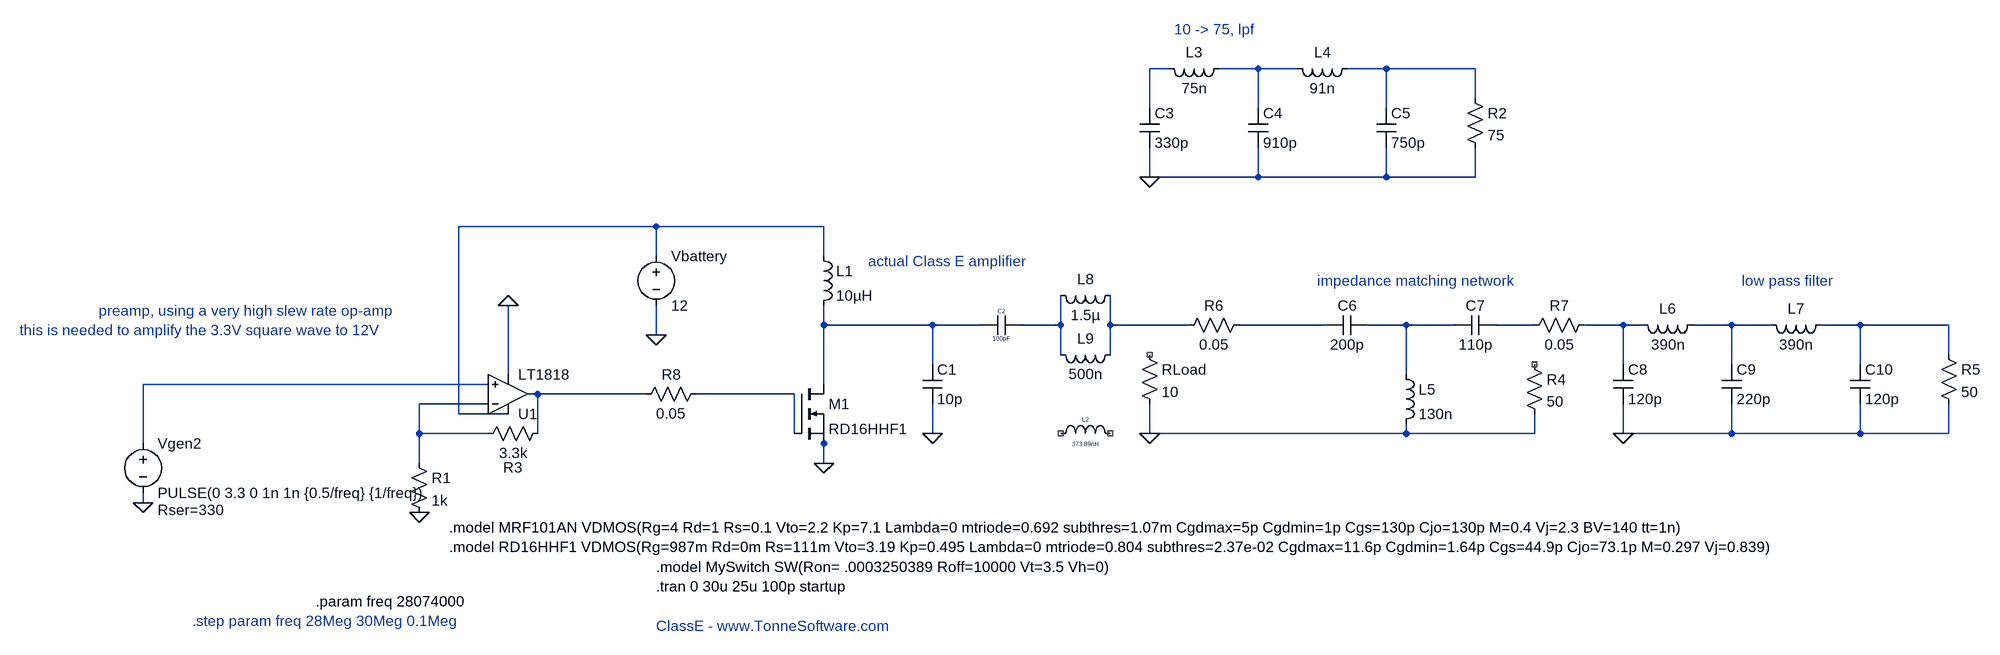
[diagram p0: schematic class_e_10mhz_opt2_real_components.asc]
class_e_10mhz_opt2_real_components.asc, the LTspice schematic file:
Version 4
SHEET 1 2440 912
WIRE 832 -528 800 -528
WIRE 976 -528 912 -528
WIRE 1040 -528 976 -528
WIRE 1184 -528 1120 -528
WIRE 1328 -528 1184 -528
WIRE 1328 -480 1328 -528
WIRE 800 -464 800 -528
WIRE 976 -464 976 -528
WIRE 1184 -464 1184 -528
WIRE 800 -352 800 -400
WIRE 976 -352 976 -400
WIRE 976 -352 800 -352
WIRE 1184 -352 1184 -400
WIRE 1184 -352 976 -352
WIRE 1328 -352 1328 -400
WIRE 1328 -352 1184 -352
WIRE 0 -272 -320 -272
WIRE 272 -272 0 -272
WIRE 0 -224 0 -272
WIRE 272 -224 272 -272
WIRE 272 -112 272 -144
WIRE 448 -112 272 -112
WIRE 528 -112 448 -112
WIRE 656 -112 656 -160
WIRE 656 -112 592 -112
WIRE 736 -112 736 -160
WIRE 864 -112 736 -112
WIRE 1088 -112 944 -112
WIRE 1216 -112 1152 -112
WIRE 1296 -112 1216 -112
WIRE 1424 -112 1360 -112
WIRE 1568 -112 1504 -112
WIRE 1600 -112 1568 -112
WIRE 1744 -112 1680 -112
WIRE 1808 -112 1744 -112
WIRE 1952 -112 1888 -112
WIRE 2096 -112 1952 -112
WIRE 0 -96 0 -144
WIRE 656 -64 656 -112
WIRE 736 -64 736 -112
WIRE 2096 -64 2096 -112
WIRE 448 -48 448 -112
WIRE 1568 -48 1568 -112
WIRE 1744 -48 1744 -112
WIRE 1952 -48 1952 -112
WIRE -240 -32 -240 -144
WIRE 1216 -32 1216 -112
WIRE -272 -16 -832 -16
WIRE 272 -16 272 -112
WIRE -192 0 -208 0
WIRE -16 0 -192 0
WIRE 224 0 64 0
WIRE -272 16 -384 16
WIRE -320 32 -320 -272
WIRE -240 32 -320 32
WIRE -384 64 -384 16
WIRE -272 64 -384 64
WIRE -192 64 -192 0
WIRE 224 64 224 0
WIRE 448 64 448 16
WIRE 800 64 800 16
WIRE 1216 64 1216 48
WIRE 1216 64 800 64
WIRE 1424 64 1424 32
WIRE 1424 64 1216 64
WIRE 1568 64 1568 16
WIRE 1744 64 1744 16
WIRE 1744 64 1568 64
WIRE 1952 64 1952 16
WIRE 1952 64 1744 64
WIRE 2096 64 2096 16
WIRE 2096 64 1952 64
WIRE -832 80 -832 -16
WIRE 272 80 272 64
WIRE -384 112 -384 64
WIRE 272 112 272 80
WIRE -832 176 -832 160
FLAG 272 112 0
FLAG 0 -96 0
FLAG 448 64 0
FLAG 800 64 0
FLAG -832 176 0
FLAG -384 192 0
FLAG -240 -144 0
FLAG 800 -352 0
FLAG 1568 64 0
SYMBOL voltage 0 -240 R0
WINDOW 123 24 132 Left 0
WINDOW 39 0 0 Left 0
SYMATTR InstName Vbattery
SYMATTR Value 12
SYMBOL ind 256 -240 R0
SYMATTR InstName L1
SYMATTR Value 10µH
SYMBOL cap 432 -48 R0
SYMATTR InstName C1
SYMATTR Value 10p
SYMBOL cap 592 -128 R90
WINDOW 0 0 32 VBottom 0
WINDOW 3 32 32 VTop 0
SYMATTR InstName C2
SYMATTR Value 100pF
SYMBOL ind 640 80 R270
WINDOW 0 32 56 VTop 0
WINDOW 3 5 56 VBottom 0
SYMATTR InstName L2
SYMATTR Value 373.89nH
SYMBOL res 784 -80 R0
SYMATTR InstName RLoad
SYMATTR Value 10
SYMBOL nmos 224 -16 R0
SYMATTR InstName M1
SYMATTR Value RD16HHF1
SYMBOL voltage -832 64 R0
WINDOW 123 24 132 Left 0
WINDOW 39 24 124 Left 2
SYMATTR SpiceLine Rser=330
SYMATTR InstName Vgen2
SYMATTR Value PULSE(0 3.3 0 1n 1n {0.5/freq} {1/freq})
SYMBOL res -400 96 R0
SYMATTR InstName R1
SYMATTR Value 1k
SYMBOL res -176 48 R90
WINDOW 0 86 57 VBottom 2
WINDOW 3 32 56 VTop 2
SYMATTR InstName R3
SYMATTR Value 3.3k
SYMBOL OpAmps\\LT1818 -240 0 M180
SYMATTR InstName U1
SYMBOL ind 928 -544 R90
WINDOW 0 5 56 VBottom 2
WINDOW 3 32 56 VTop 2
SYMATTR InstName L3
SYMATTR Value 75n
SYMBOL ind 1136 -544 R90
WINDOW 0 5 56 VBottom 2
WINDOW 3 32 56 VTop 2
SYMATTR InstName L4
SYMATTR Value 91n
SYMBOL cap 784 -464 R0
SYMATTR InstName C3
SYMATTR Value 330p
SYMBOL cap 960 -464 R0
SYMATTR InstName C4
SYMATTR Value 910p
SYMBOL cap 1168 -464 R0
SYMATTR InstName C5
SYMATTR Value 750p
SYMBOL res 1312 -496 R0
SYMATTR InstName R2
SYMATTR Value 75
SYMBOL cap 1152 -128 R90
WINDOW 0 0 32 VBottom 2
WINDOW 3 32 32 VTop 2
SYMATTR InstName C6
SYMATTR Value 200p
SYMBOL ind 1200 -48 R0
SYMATTR InstName L5
SYMATTR Value 130n
SYMBOL cap 1360 -128 R90
WINDOW 0 0 32 VBottom 2
WINDOW 3 32 32 VTop 2
SYMATTR InstName C7
SYMATTR Value 110p
SYMBOL res 1408 -64 R0
SYMATTR InstName R4
SYMATTR Value 50
SYMBOL ind 1696 -128 R90
WINDOW 0 5 56 VBottom 2
WINDOW 3 32 56 VTop 2
SYMATTR InstName L6
SYMATTR Value 390n
SYMBOL ind 1904 -128 R90
WINDOW 0 5 56 VBottom 2
WINDOW 3 32 56 VTop 2
SYMATTR InstName L7
SYMATTR Value 390n
SYMBOL cap 1552 -48 R0
SYMATTR InstName C8
SYMATTR Value 120p
SYMBOL cap 1728 -48 R0
SYMATTR InstName C9
SYMATTR Value 220p
SYMBOL cap 1936 -48 R0
SYMATTR InstName C10
SYMATTR Value 120p
SYMBOL res 2080 -80 R0
SYMATTR InstName R5
SYMATTR Value 50
SYMBOL ind 752 -176 R90
WINDOW 0 5 56 VBottom 2
WINDOW 3 32 56 VTop 2
SYMATTR InstName L8
SYMATTR Value 1.5µ
SYMBOL ind 752 -80 R90
WINDOW 0 5 56 VBottom 2
WINDOW 3 32 56 VTop 2
SYMATTR InstName L9
SYMATTR Value 500n
SYMBOL res 960 -128 R90
WINDOW 0 0 56 VBottom 2
WINDOW 3 32 56 VTop 2
SYMATTR InstName R6
SYMATTR Value 0.05
SYMBOL res 1520 -128 R90
WINDOW 0 0 56 VBottom 2
WINDOW 3 32 56 VTop 2
SYMATTR InstName R7
SYMATTR Value 0.05
SYMBOL res 80 -16 R90
WINDOW 0 0 56 VBottom 2
WINDOW 3 32 56 VTop 2
SYMATTR InstName R8
SYMATTR Value 0.05
TEXT 0 280 Left 2 !.model MySwitch SW(Ron= .0003250389 Roff=10000 Vt=3.5 Vh=0)
TEXT 0 312 Left 2 !.tran 0 30u 25u 100p startup
TEXT 0 376 Left 2 ;ClassE - www.TonneSoftware.com
TEXT -336 248 Left 2 !.model RD16HHF1 VDMOS(Rg=987m Rd=0m Rs=111m Vto=3.19 Kp=0.495 Lambda=0 mtriode=0.804 subthres=2.37e-02 Cgdmax=11.6p Cgdmin=1.64p Cgs=44.9p Cjo=73.1p M=0.297 Vj=0.839)
TEXT -904 -136 Left 2 ;preamp, using a very high slew rate op-amp
TEXT -1032 -104 Left 2 ;this is needed to amplify the 3.3V square wave to 12V
TEXT 344 -216 Left 2 ;actual Class E amplifier
TEXT -552 336 Left 2 !.param freq 28074000
TEXT -752 368 Left 2 ;.step param freq 28Meg 30Meg 0.1Meg
TEXT 840 -592 Left 2 ;10 -> 75, lpf
TEXT 1072 -184 Left 2 ;impedance matching network
TEXT 1760 -184 Left 2 ;low pass filter
TEXT -336 216 Left 2 !.model MRF101AN VDMOS(Rg=4 Rd=1 Rs=0.1 Vto=2.2 Kp=7.1 Lambda=0 mtriode=0.692 subthres=1.07m Cgdmax=5p Cgdmin=1p Cgs=130p Cjo=130p M=0.4 Vj=2.3 BV=140 tt=1n)

The netlist it stands for:
* class_e_10mhz_opt2_real_components.asc
Vbattery N004 0 12
L1 N004 N005 10µH
C1 N005 0 10p
C2 N006 N005 100pF
L2 NC_01 NC_02 373.89nH
RLoad NC_03 0 10
M1 N005 N016 0 0 RD16HHF1
Vgen2 N014 0 PULSE(0 3.3 0 1n 1n {0.5/freq} {1/freq}) Rser=330
R1 N017 0 1k
R3 N015 N017 3.3k
XU1 N014 N017 N015 N004 0 LT1818  ; pins In+ In- OUT V+ V-
L3 N002 N001 75n
L4 N003 N002 91n
C3 N001 0 330p
C4 N002 0 910p
C5 N003 0 750p
R2 N003 0 75
C6 N009 N008 200p
L5 N009 0 130n
C7 N010 N009 110p
R4 NC_04 0 50
L6 N012 N011 390n
L7 N013 N012 390n
C8 N011 0 120p
C9 N012 0 220p
C10 N013 0 120p
R5 N013 0 50
L8 N007 N006 1.5µ
L9 N007 N006 500n
R6 N008 N007 0.05
R7 N011 N010 0.05
R8 N016 N015 0.05
.model NMOS NMOS
.model PMOS PMOS
.lib standard.mos
.model MySwitch SW(Ron= .0003250389 Roff=10000 Vt=3.5 Vh=0)
.tran 0 30u 25u 100p startup
* ClassE - www.TonneSoftware.com
.model RD16HHF1 VDMOS(Rg=987m Rd=0m Rs=111m Vto=3.19 Kp=0.495 Lambda=0 mtriode=0.804 subthres=2.37e-02 Cgdmax=11.6p Cgdmin=1.64p Cgs=44.9p Cjo=73.1p M=0.297 Vj=0.839)
* preamp, using a very high slew rate op-amp
* this is needed to amplify the 3.3V square wave to 12V
* actual Class E amplifier
.param freq 28074000
* .step param freq 28Meg 30Meg 0.1Meg
* 10 -> 75, lpf
* impedance matching network
* low pass filter
.model MRF101AN VDMOS(Rg=4 Rd=1 Rs=0.1 Vto=2.2 Kp=7.1 Lambda=0 mtriode=0.692 subthres=1.07m Cgdmax=5p Cgdmin=1p Cgs=130p Cjo=130p M=0.4 Vj=2.3 BV=140 tt=1n)
.lib LTC2.lib
.backanno
.end